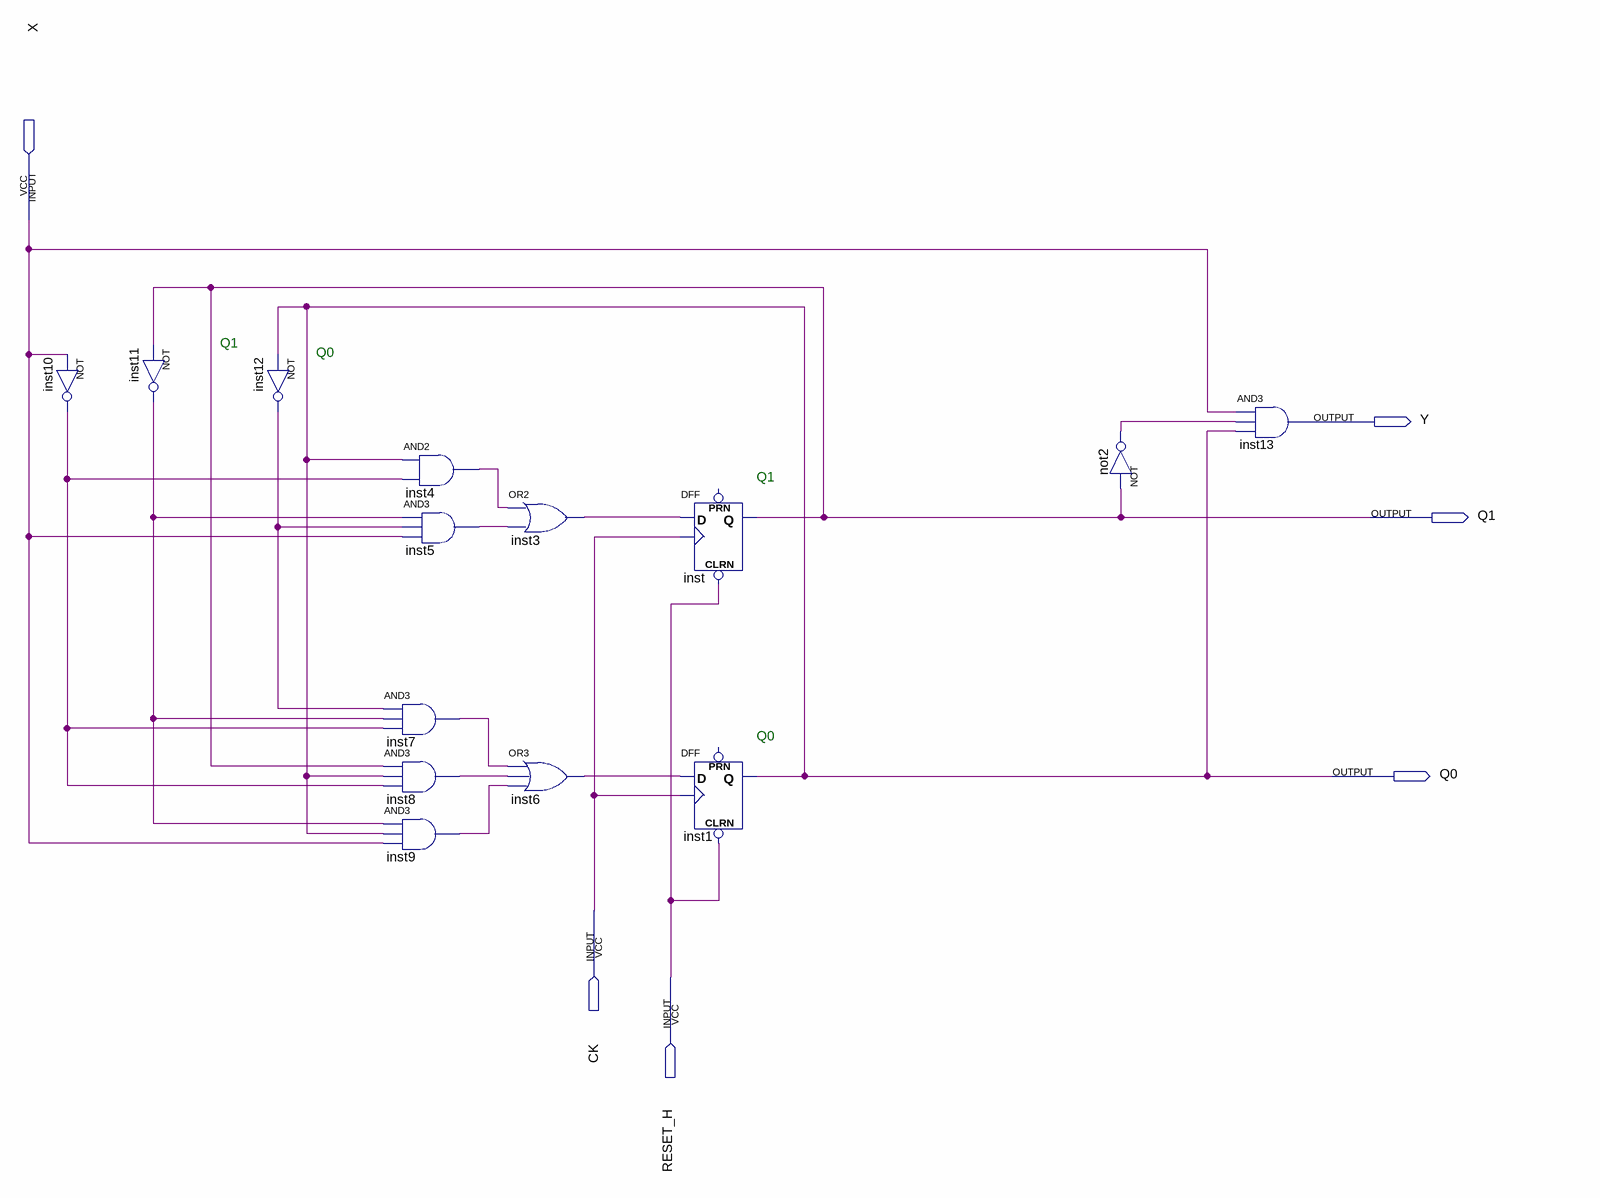
[diagram p0: schematic sheet]
// Quartus schematic FSM.bdf as structural Verilog: 14 symbols, 6 pins
module FSM (
  input  X,
  input  CK,
  input  RESET_H,
  output Y,
  output Q1,
  output Q0
);

  wire inst3_out, inst4_out, inst5_out, inst6_out, inst7_out, inst8_out, inst9_out, inst10_out, inst11_out,
       inst12_out, not2_out;

  not inst10 (inst10_out, X);
  not inst11 (inst11_out, Q1);
  not inst12 (inst12_out, Q0);
  and inst4 (inst4_out, Q0, inst10_out);
  and inst5 (inst5_out, inst11_out, inst12_out, X);
  and inst7 (inst7_out, inst12_out, inst11_out, inst10_out);
  and inst8 (inst8_out, Q1, Q0, inst10_out);
  and inst9 (inst9_out, inst11_out, Q0, X);
  or inst3 (inst3_out, inst4_out, inst5_out);
  or inst6 (inst6_out, inst7_out, inst8_out, inst9_out);
  DFF inst (.CLRN(RESET_H), .CLK(CK), .D(inst3_out), .Q(Q1));  // open: PRN
  DFF inst1 (.CLRN(RESET_H), .CLK(CK), .D(inst6_out), .Q(Q0));  // open: PRN
  not not2 (not2_out, Q1);
  and inst13 (Y, X, not2_out, Q0);

  // Notes on the sheet:
  //   Q1
  //   Q0
  //   Q1
  //   Q0
endmodule
